# EAGLE schematic SENSOR_BOARD_2_1_layer (EAGLE 6.6.0)
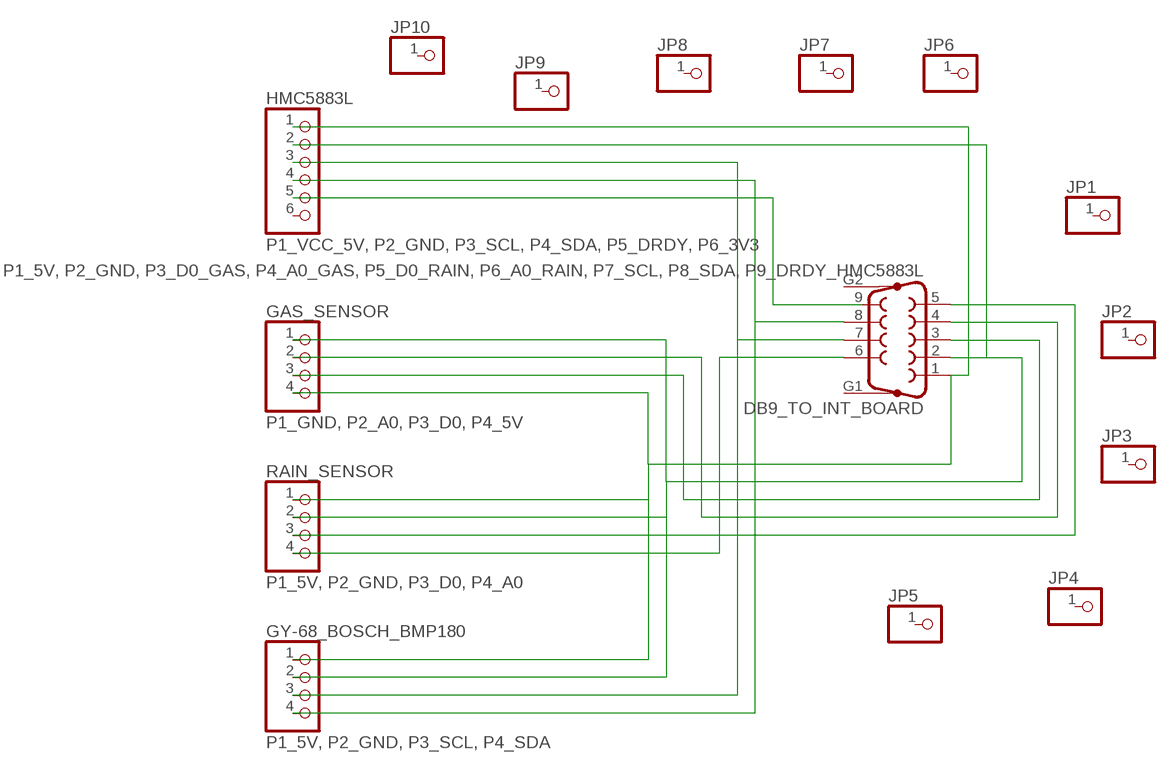
[diagram p0: schematic, sheet 1]

## Parts
DB9_TO_INT_BOARD  P1_5V, P2_GND, P3_D0_GAS, P4_A0_GAS, P5_D0_RAIN, P6_A0_RAIN, P7_SCL, P8_SDA, P9_DRDY_HMC5883L  F09HP  [F09HP]
GAS_SENSOR  P1_GND, P2_A0, P3_D0, P4_5V  PINHD-1X4  [1X04]
GY-68_BOSCH_BMP180  P1_5V, P2_GND, P3_SCL, P4_SDA  PINHD-1X4  [1X04]
HMC5883L  P1_VCC_5V, P2_GND, P3_SCL, P4_SDA, P5_DRDY, P6_3V3  PINHD-1X6  [1X06]
JP1  PINHD-1X1  [1X01]
JP2  PINHD-1X1  [1X01]
JP3  PINHD-1X1  [1X01]
JP4  PINHD-1X1  [1X01]
JP5  PINHD-1X1  [1X01]
JP6  PINHD-1X1  [1X01]
JP7  PINHD-1X1  [1X01]
JP8  PINHD-1X1  [1X01]
JP9  PINHD-1X1  [1X01]
JP10  PINHD-1X1  [1X01]
RAIN_SENSOR  P1_5V, P2_GND, P3_D0, P4_A0  PINHD-1X4  [1X04]

## Nets
N$1: DB9_TO_INT_BOARD.1 GAS_SENSOR.4 GY-68_BOSCH_BMP180.1 HMC5883L.1 RAIN_SENSOR.1
N$2: DB9_TO_INT_BOARD.2 GAS_SENSOR.1 GY-68_BOSCH_BMP180.2 HMC5883L.2 RAIN_SENSOR.2
N$3: DB9_TO_INT_BOARD.3 GAS_SENSOR.3
N$4: DB9_TO_INT_BOARD.4 GAS_SENSOR.2
N$5: DB9_TO_INT_BOARD.5 RAIN_SENSOR.3
N$6: DB9_TO_INT_BOARD.6 RAIN_SENSOR.4
N$7: DB9_TO_INT_BOARD.7 GY-68_BOSCH_BMP180.3 HMC5883L.3
N$8: DB9_TO_INT_BOARD.8 GY-68_BOSCH_BMP180.4 HMC5883L.4
N$9: HMC5883L.5
Unconnected: DB9_TO_INT_BOARD.9 DB9_TO_INT_BOARD.G1 DB9_TO_INT_BOARD.G2 HMC5883L.6 JP1.1 JP2.1 JP3.1 JP4.1 JP5.1 JP6.1 JP7.1 JP8.1 JP9.1 JP10.1

## Library data of the parts
DB9_TO_INT_BOARD = con-subd:F09HP: SUB-D; OC_FARNELL: unknown; OC_NEWARK: unknown
GAS_SENSOR GY-68_BOSCH_BMP180 RAIN_SENSOR = pinhead:PINHD-1X4: PIN HEADER
HMC5883L = pinhead:PINHD-1X6: PIN HEADER
JP1-JP10 = pinhead:PINHD-1X1: PIN HEADER